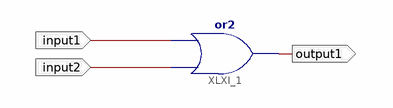
[diagram p0: schematic sheet 1]
// Xilinx ISE schematic Orckt.sch (spartan6) as structural Verilog: 1 symbols, 3 ports
module Orckt (
  input  input1,
  input  input2,
  output output1
);

  or XLXI_1 (output1, input2, input1);
endmodule
